# EAGLE schematic shield (EAGLE 8.5.2)
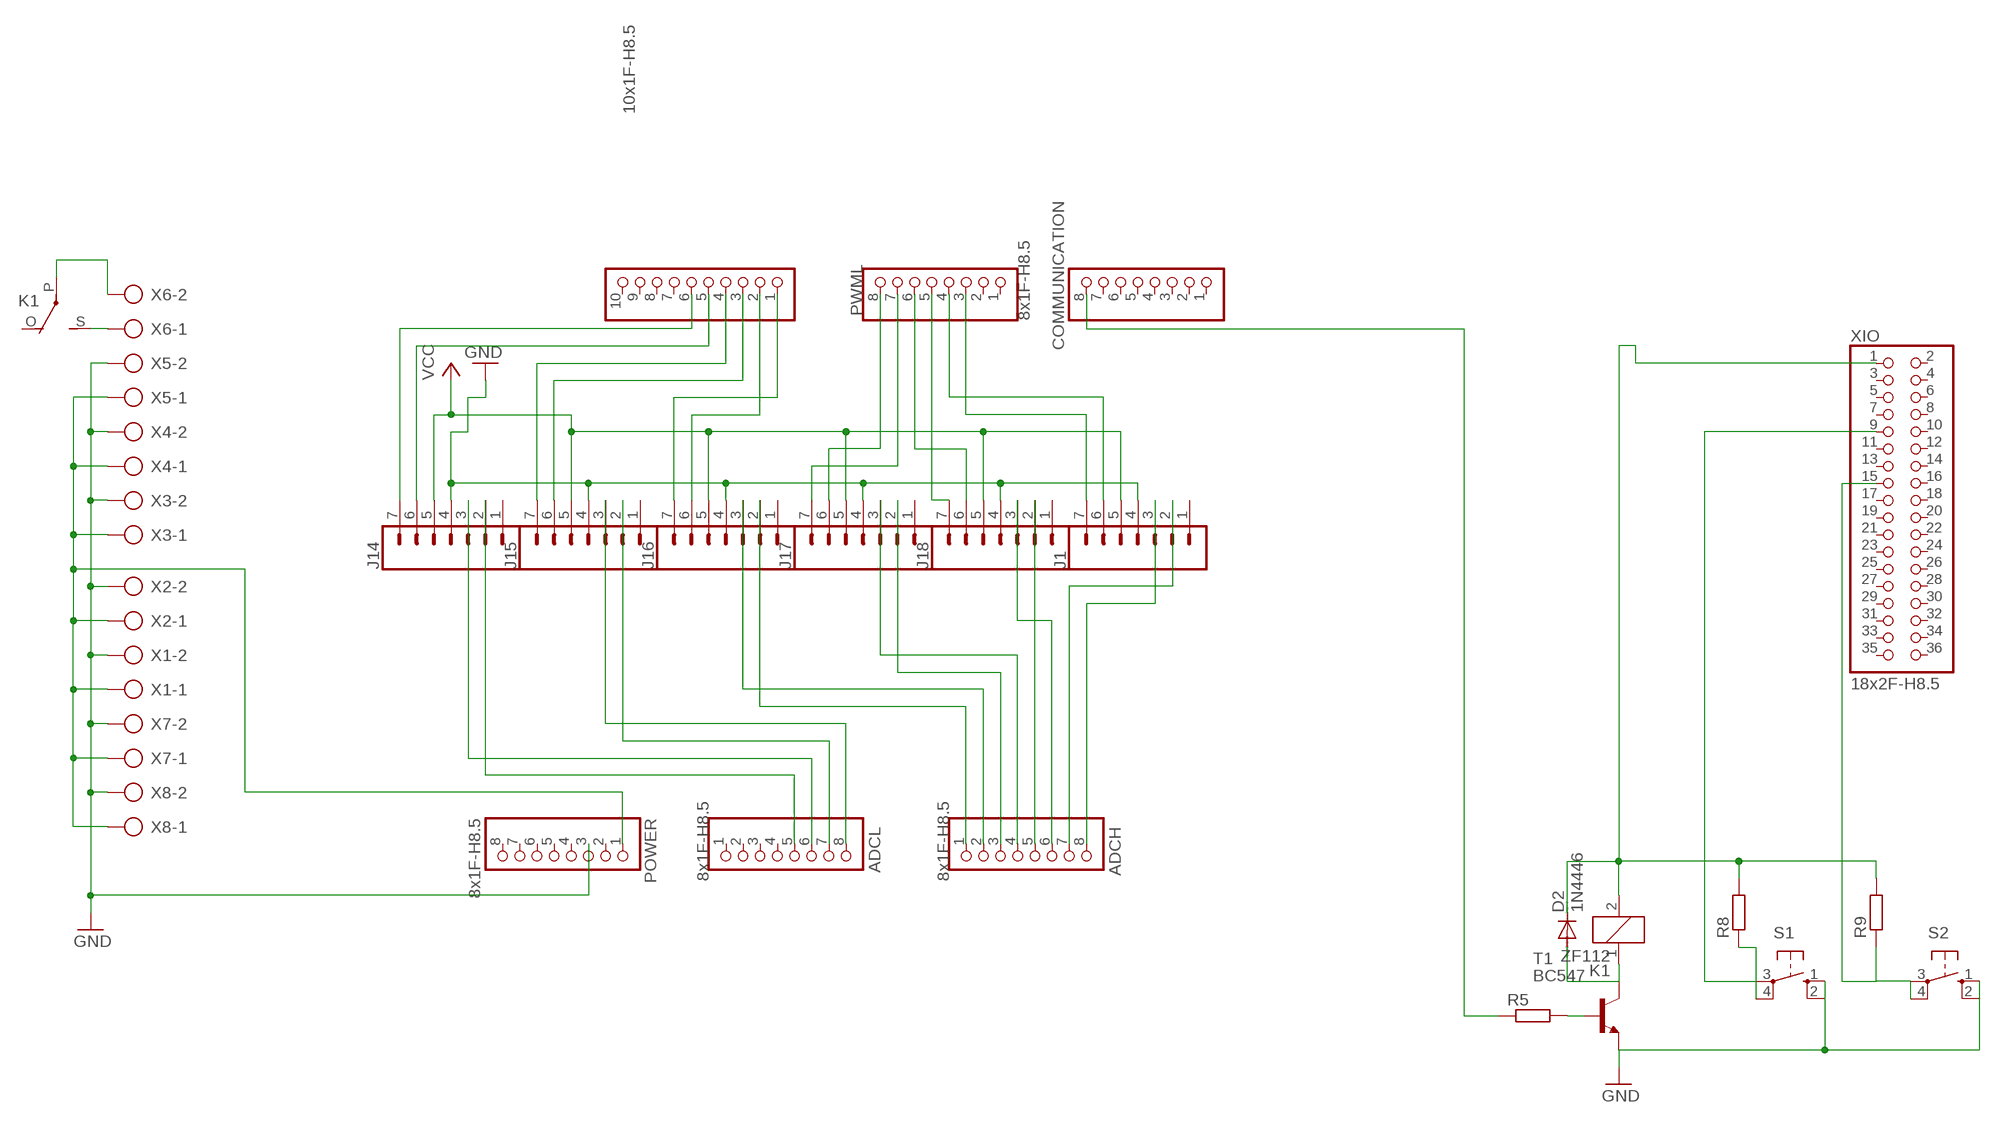
[diagram p0: schematic, sheet 1]

## Parts
ADCH  8x1F-H8.5  PINHD-1X8  [1X08]
ADCL  8x1F-H8.5  PINHD-1X8  [1X08]
COMMUNICATION  8x1F-H8.5  PINHD-1X8  [1X08]
D2  1N4446  [DO35-10]
J1  CONN_07LONGPADS  [1X07_LONGPADS]
J14  CONN_07LONGPADS  [1X07_LONGPADS]
J15  CONN_07LONGPADS  [1X07_LONGPADS]
J16  CONN_07LONGPADS  [1X07_LONGPADS]
J17  CONN_07LONGPADS  [1X07_LONGPADS]
J18  CONN_07LONGPADS  [1X07_LONGPADS]
K1  ZF112  [ZF112]
POWER  8x1F-H8.5  PINHD-1X8  [1X08]
PWMH  10x1F-H8.5  PINHD-1X10  [1X10]
PWML  8x1F-H8.5  PINHD-1X8  [1X08]
R5  R-EU_0204/7  [0204/7]
R8  R-EU_0204/7  [0204/7]
R9  R-EU_0204/7  [0204/7]
S1  10-XX  [B3F-10XX]
S2  10-XX  [B3F-10XX]
T1  BC547  [TO92]
X1  AK500/2  [AK500/2]
X2  AK500/2  [AK500/2]
X3  AK500/2  [AK500/2]
X4  AK500/2  [AK500/2]
X5  AK500/2  [AK500/2]
X6  AK500/2  [AK500/2]
X7  AK500/2  [AK500/2]
X8  AK500/2  [AK500/2]
XIO  18x2F-H8.5  PINHD-2X18  [2X18]

## Nets
GND: J1.4 J14.4 J15.4 J16.4 J17.4 J18.4 POWER.3 S1.1(S) S1.2(S1) S2.1(S) S2.2(S1) T1.1(E) X1.2 X2.2 X3.2 X4.2 X5.2 X7.2 X8.2
N$1: J14.7 PWMH.6
N$2: D2.C K1.2 R8.2 R9.2 XIO.1
N$3: K1.S(2:S) X6.1
N$4: K1.P(2:P) X6.2
N$7: J14.6 PWMH.5
N$9: J15.7 PWMH.4
N$10: J15.6 PWMH.3
N$11: ADCH.7 J1.2
N$12: POWER.1 X1.1 X2.1 X3.1 X4.1 X5.1 X7.1 X8.1
N$13: ADCH.8 J1.3
N$14: J17.6 PWML.8
N$15: COMMUNICATION.8 R5.1
N$16: J16.7 PWMH.1
N$17: J16.6 PWMH.2
N$18: J18.7 PWML.5
N$19: R5.2 T1.2(B)
N$20: J17.7 PWML.7
N$21: J18.6 PWML.6
N$22: J1.7 PWML.3
N$23: J1.6 PWML.4
N$28: ADCL.6 J14.3
N$29: ADCL.5 J14.2
N$30: ADCH.6 J18.3
N$31: ADCH.5 J18.2
N$32: ADCH.4 J17.3
N$34: ADCH.3 J17.2
N$35: ADCH.2 J16.3
N$36: ADCH.1 J16.2
N$37: ADCL.8 J15.3
N$40: ADCL.7 J15.2
N$68: D2.A K1.1 T1.3(C)
N$69: R8.1 S1.3(P) S1.4(P1) XIO.9
N$74: R9.1 S2.3(P) S2.4(P1) XIO.15
VCC: J1.5 J14.5 J15.5 J16.5 J17.5 J18.5
Unconnected: ADCL.1 ADCL.2 ADCL.3 ADCL.4 COMMUNICATION.1 COMMUNICATION.2 COMMUNICATION.3 COMMUNICATION.4 COMMUNICATION.5 COMMUNICATION.6 COMMUNICATION.7 J1.1 J14.1 J15.1 J16.1 J17.1 J18.1 K1.O(2:O) POWER.2 POWER.4 POWER.5 POWER.6 POWER.7 POWER.8 PWMH.7 PWMH.8 PWMH.9 PWMH.10 PWML.1 PWML.2 XIO.2 XIO.3 XIO.4 XIO.5 XIO.6 XIO.7 XIO.8 XIO.10 XIO.11 XIO.12 XIO.13 XIO.14 XIO.16 XIO.17 XIO.18 XIO.19 XIO.20 XIO.21 XIO.22 XIO.23 XIO.24 XIO.25 XIO.26 XIO.27 XIO.28 XIO.29 XIO.30 XIO.31 XIO.32 XIO.33 XIO.34 XIO.35 XIO.36

## Library data of the parts
ADCH ADCL COMMUNICATION POWER PWML = SmartPrj:PINHD-1X8: PIN HEADER
D2 = diode:1N4446: DIODE high speed (Philips)
J1 J14-J18 = SparkFun-Connectors:CONN_07: Multi connection point. Often used as Generic Header-pin footprint for 0.1 inch spaced/style header connections On any of the 0.1 inch spaced packages, you can populate with these: Break Away Headers - Straight <https://www.sparkfun.com/products/116> (PRT-00116) Break Away Male Headers - Right Angle <https://www.sparkfun.com/products/553> (PRT-00553) Female Headers <https://www.sparkfun.com/products/115> (PRT-00115) Break Away Headers - Machine Pin <https://www.sparkfun.com/products/117> (PRT-00117) Break Away Female Headers - Swiss Machine Pin <https://www.sparkfun.com/products/743> (PRT-00743) For SCREWTERMINALS and SPRING TERMINALS visit here: Screw Terimnals on SparkFun.com <https://www.sparkfun.com/search/results?term=Screw+Terminals> (5mm/3.5mm/2.54mm spacing) This device is also useful as a general connection point to wire up your design to another part of your project. Our various solder wires solder well into these plated through hole pads. Hook-Up Wire - Assortment (Stranded, 22 AWG) <https://www.sparkfun.com/products/11375> (PRT-11375) Hook-Up Wire - Assortment (Solid Core, 22 AWG) <https://www.sparkfun.com/products/11367> (PRT-11367) View the entire wire category on our website here <https://www.sparkfun.com/categories/141> Special notes: Molex polarized connector foot print use with SKU : PRT-08231 with associated crimp pins and housings. 1MM SMD Version SKU: PRT-10208 NOTES ON THE VARIANTS LOCK and LOCK_LONGPADS... This footprint was designed to help hold the alignment of a through-hole component (i.e. 6-pin header) while soldering it into place. You may notice that each hole has been shifted either up or down by 0.005 of an inch from it's more standard position (which is a perfectly straight line). This slight alteration caused the pins (the squares in the middle) to touch the edges of the holes. Because they are alternating, it causes a "brace" to hold the component in place. 0.005 has proven to be the perfect amount of "off-center" position when using our standard breakaway headers. Although looks a little odd when you look at the bare footprint, once you have a header in there, the alteration is very hard to notice. Also,if you push a header all the way into place, it is covered up entirely on the bottom side.
K1 = relay:ZF112: RELAY 1 x switch; OC_FARNELL: unknown; OC_NEWARK: unknown
PWMH = SmartPrj:PINHD-1X10: PIN HEADER
R5 R8 R9 = rcl:R-EU_: RESISTOR, European symbol
S1 S2 = switch-omron:10-XX: OMRON SWITCH; MPN: B3F-1000; OC_FARNELL: 176432; OC_NEWARK: 36M3542
T1 = transistor:BC547: NPN TRANSISTOR
X1-X8 = con-ptr500:AK500/2: CONNECTOR; OC_FARNELL: unknown; OC_NEWARK: unknown
XIO = SmartPrj:PINHD-2X18: PIN HEADER

## Net classes
0 default: width 0.203 mm, drill 0.406 mm, clearance 0.203 mm
1 USB: width 0.203 mm, drill 0.406 mm, clearance 0.203 mm
2 gnd: width 0.203 mm, drill 0.406 mm, clearance 0.203 mm
3 usbvcc: width 0.203 mm, drill 0.406 mm, clearance 0.203 mm
4 USBpair: width 0.254 mm, drill 0.406 mm, clearance 0.61 mm